# EAGLE design TSOC_GROVEY_ONE_R0_1 (EAGLE 6.6.0)
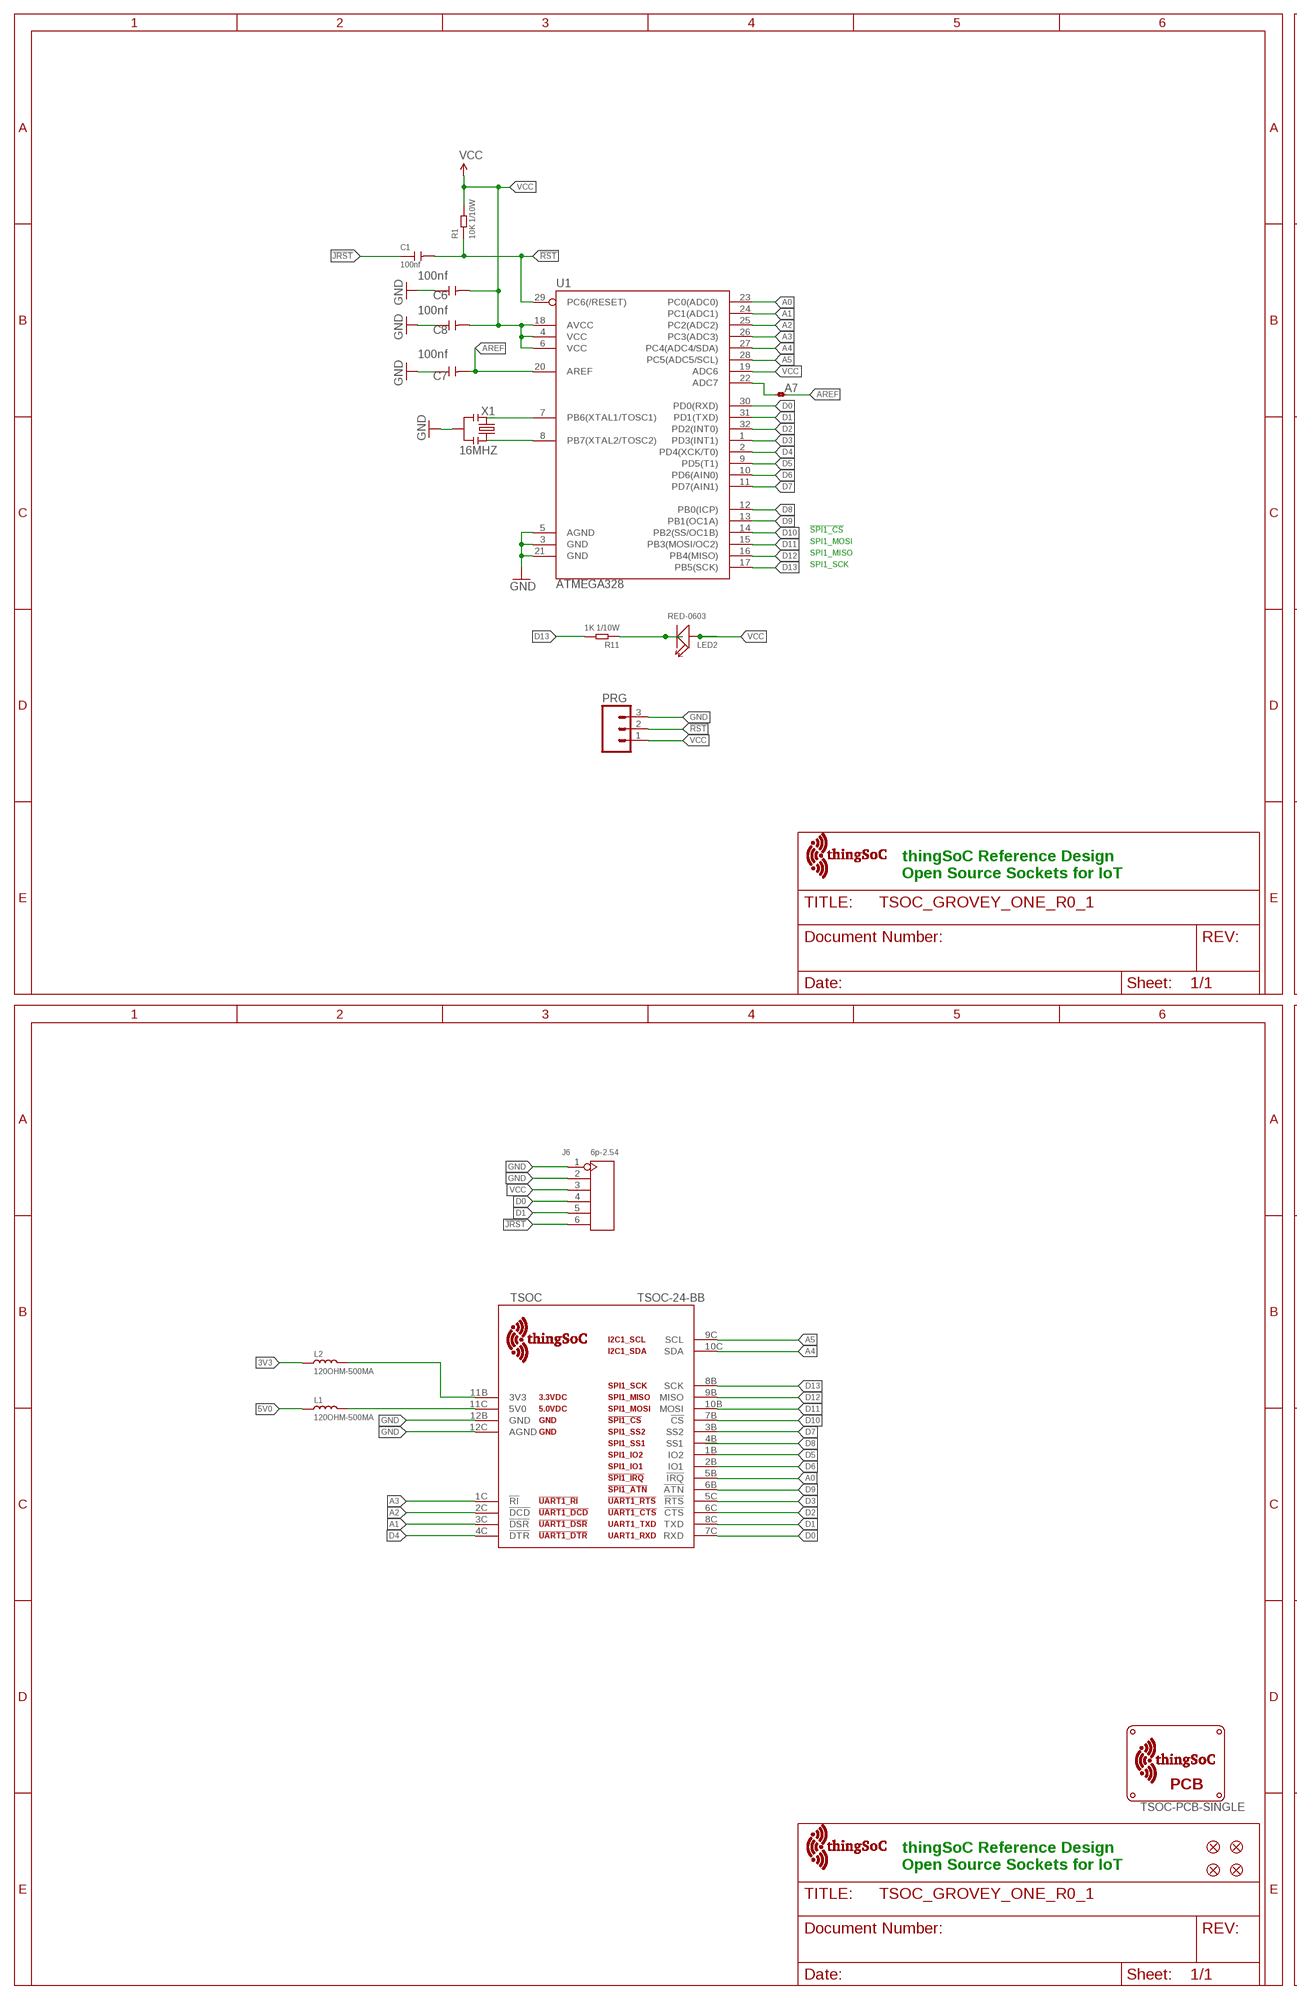
[diagram p0: schematic, sheet 1, part 1 of 2]
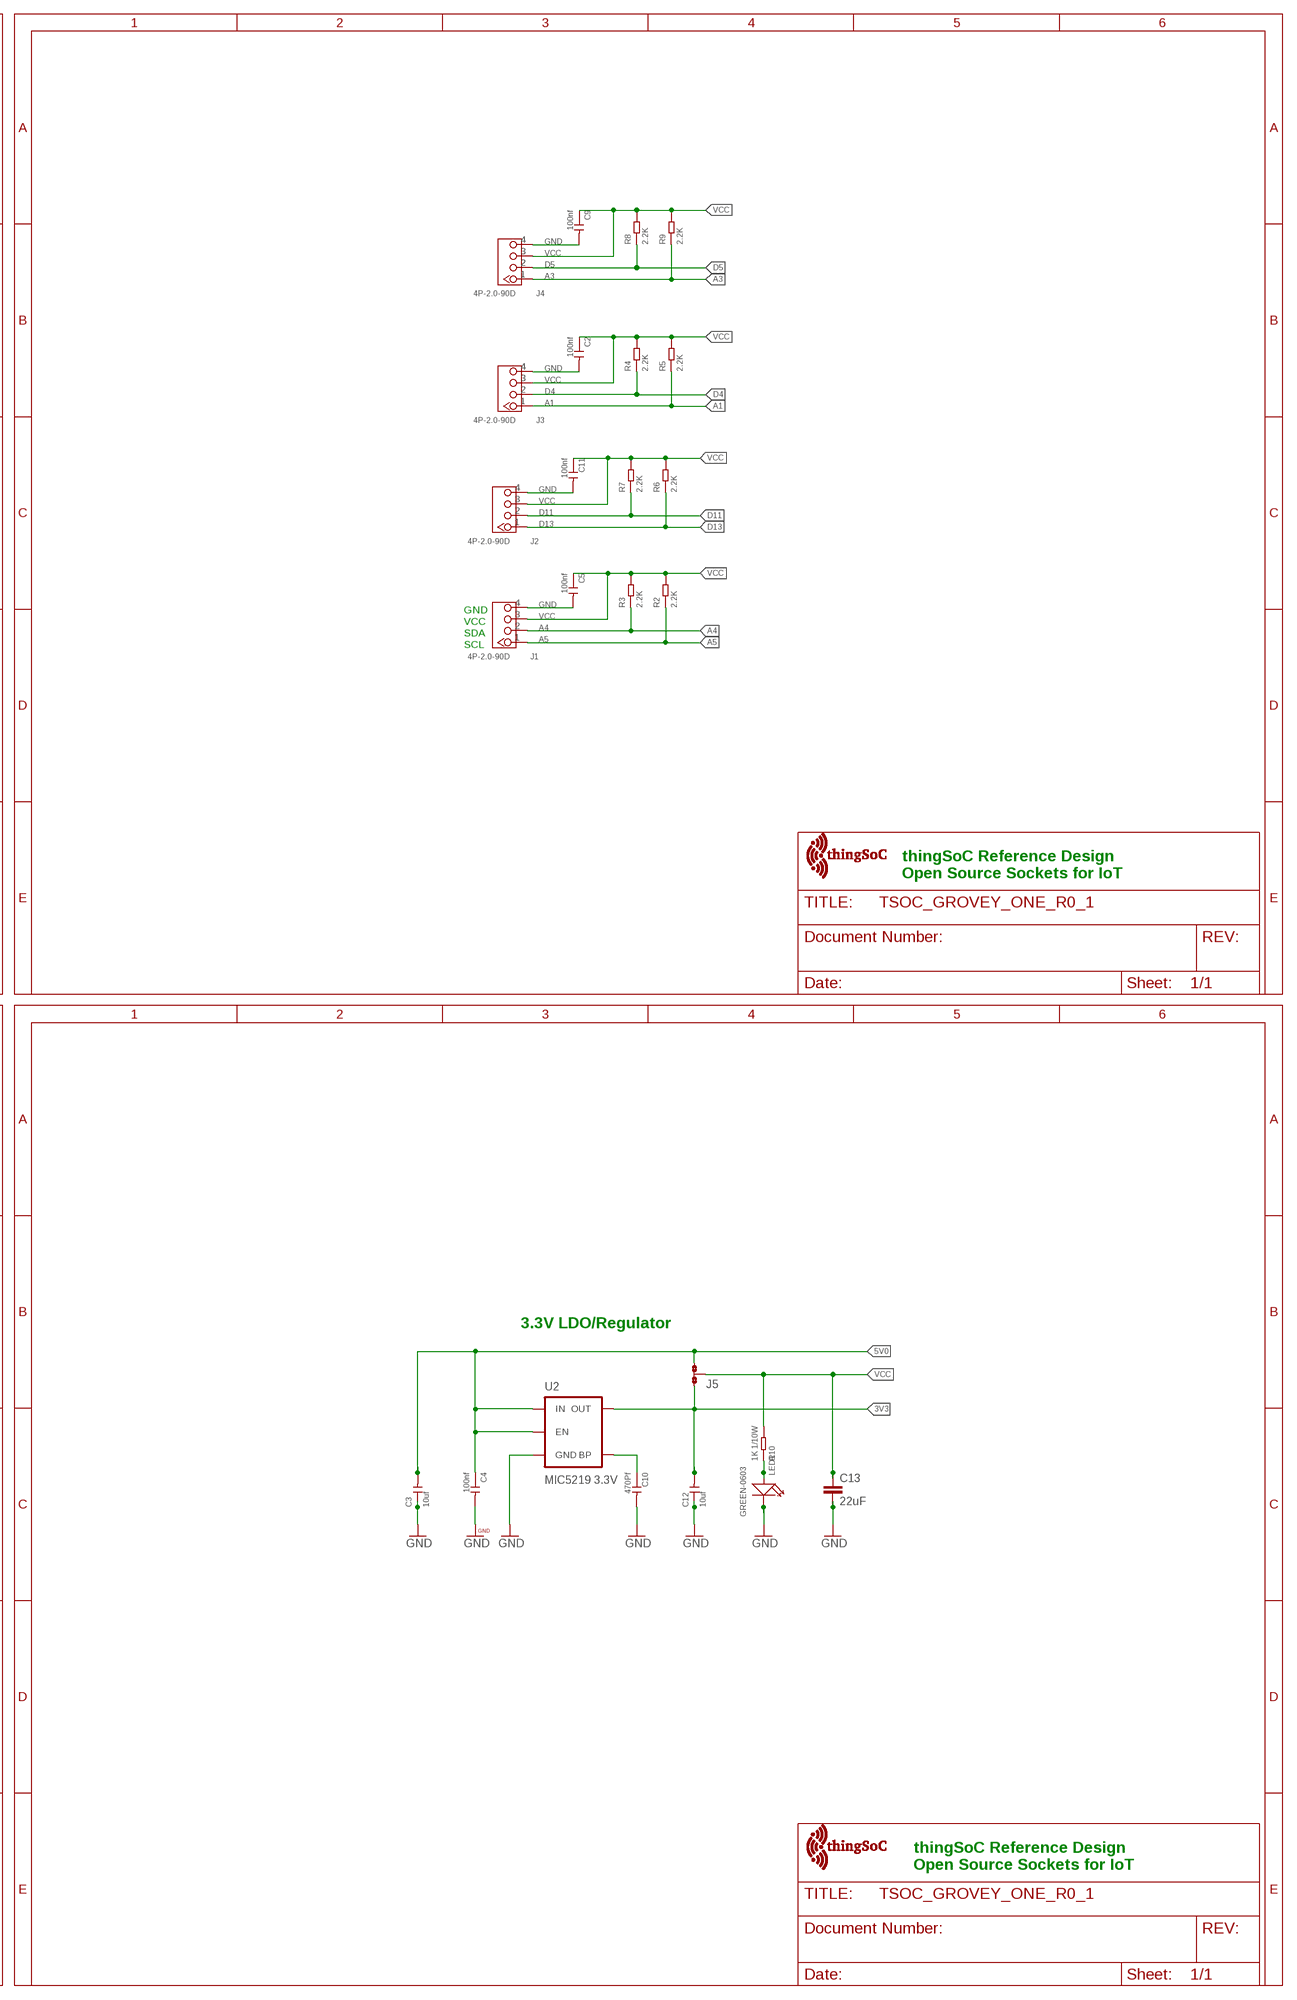
[diagram p1: schematic, sheet 1, part 2 of 2]

## Parts
$$U$2  TSOC-PCB-SINGLE  [TSOC-BB-BRD-DIM]
A7  JMP-2-NO  [JMP-2-NO]
C1  100nf  CERAMIC-100NF-50V-10%-X7R(0603)  [C0603]
C2  100nf  CERAMIC-100NF-50V-10%-X7R(0603)  [C0603]
C3  10uf  CERAMIC-10UF-10V-10%-X5R(0603)  [C0603]
C4  100nf  CERAMIC-100NF-50V-10%-X7R(0603)  [C0603]
C5  100nf  CERAMIC-100NF-50V-10%-X7R(0603)  [C0603]
C6  100nf  CERAMIC-100NF-50V-10%-X7R(0603)  [C0603]
C7  100nf  CERAMIC-100NF-50V-10%-X7R(0603)  [C0603]
C8  100nf  CERAMIC-100NF-50V-10%-X7R(0603)  [C0603]
C9  100nf  CERAMIC-100NF-50V-10%-X7R(0603)  [C0603]
C10  470Pf  CERAMIC-100NF-50V-10%-X7R(0603)  [C0603]
C11  100nf  CERAMIC-100NF-50V-10%-X7R(0603)  [C0603]
C12  10uf  CERAMIC-10UF-10V-10%-X5R(0603)  [C0603]
C13  22uF  CAP-1206  [EIA-1206]
FID1  FIDUCIALUFIDUCIAL  [MICRO-FIDUCIAL]
FID2  FIDUCIALUFIDUCIAL  [MICRO-FIDUCIAL]
FID3  FIDUCIALUFIDUCIAL  [MICRO-FIDUCIAL]
FID4  FIDUCIALUFIDUCIAL  [MICRO-FIDUCIAL]
J1  4P-2.0-90D  GROVE-CONNECTOR-DIP-90D(4P-2.0)  [HW4-2.0-90D]
J2  4P-2.0-90D  GROVE-CONNECTOR-DIP-90D(4P-2.0)  [HW4-2.0-90D]
J3  4P-2.0-90D  GROVE-CONNECTOR-DIP-90D(4P-2.0)  [HW4-2.0-90D]
J4  4P-2.0-90D  GROVE-CONNECTOR-DIP-90D(4P-2.0)  [HW4-2.0-90D]
J5  NO  JMP-3-NO-PTH  [JMP-3-NO-PTH-2.54]
J6  6p-2.54  DIP-BLACK-MALE-HEADER(6P-2.54)  [H6-2.54]
L1  120OHM-500MA  SMD-FERRITE-CHIP-120-OHM-500MA(0603)  [L0603]
L2  120OHM-500MA  SMD-FERRITE-CHIP-120-OHM-500MA(0603)  [L0603]
LED1  GREEN-0603  SMD-LED-CLEAR-GREEN(0603)  [LED-0603]
LED2  RED-0603  SMD-LED-CLEAR-GREEN(0603)  [LED-0603]
PRG  M03PTH  [1X03]
R1  10K 1/10W  SMD-RES-10K-5%-1/10W(0603)  [R0603]
R2  2.2K  SMD-RES-2.2K-5%-1/10W(0603)  [R0603]
R3  2.2K  SMD-RES-2.2K-5%-1/10W(0603)  [R0603]
R4  2.2K  SMD-RES-2.2K-5%-1/10W(0603)  [R0603]
R5  2.2K  SMD-RES-2.2K-5%-1/10W(0603)  [R0603]
R6  2.2K  SMD-RES-2.2K-5%-1/10W(0603)  [R0603]
R7  2.2K  SMD-RES-2.2K-5%-1/10W(0603)  [R0603]
R8  2.2K  SMD-RES-2.2K-5%-1/10W(0603)  [R0603]
R9  2.2K  SMD-RES-2.2K-5%-1/10W(0603)  [R0603]
R10  1K 1/10W  SMD-RES-1K-5%-1/10W(0603)  [R0603]
R11  1K 1/10W  SMD-RES-1K-5%-1/10W(0603)  [R0603]
TSOC  TSOC-24-BB  [TSOC-BB-S24]
U1  ATMEGA328  ATMEGA168  [TQFP32-08]
U2  MIC5219 3.3V  V_REG_MIC52193.3V  [SOT23-5]
U$3  TSOC-LOGO-SMALL  [TSOC-LOGO-SML]
U$100  TSOC-LOGO-SMALL  [TSOC-LOGO-SML]
U$101  TSOC-LOGO-LRG  [TSOC-LOGO-LRG]
U$103  TSOC-LOGO-SMALL  [TSOC-LOGO-SML]
X1  16MHZ  SMD-RESONATOR-16MHZ-15PF-0.5%-40R(3P-3.2X1.3MM)  [X3-SMD-3.6X1.3X0.8MM]

## Nets
3V3: C12.2 J5.1 L2.1 U2.5(OUT)
5V0: C3.2 C4.1 J5.3 L1.1 U2.1(IN) U2.3(EN)
!JRST: C1.1 J6.6
!RST: C1.2 PRG.2 R1.1 U1.29(PC6(/RESET))
A0: TSOC.5B(!IRQ) U1.23(PC0(ADC0))
A1: J3.1 R5.1 TSOC.3C(!DSR) U1.24(PC1(ADC1))
A2: TSOC.2C(!DCD) U1.25(PC2(ADC2))
A3: J4.1 R9.1 TSOC.1C(!RI) U1.26(PC3(ADC3))
A4: J1.2 R3.1 TSOC.10C(SDA) U1.27(PC4(ADC4/SDA))
A5: J1.1 R2.1 TSOC.9C(SCL) U1.28(PC5(ADC5/SCL))
A7: A7.1 U1.22(ADC7)
AREF: A7.2 C7.2 U1.20(AREF)
BYPASS1: C10.1 U2.4(BP)
D0: J6.4 TSOC.7C(RXD) U1.30(PD0(RXD))
D1: J6.5 TSOC.8C(TXD) U1.31(PD1(TXD))
D2: TSOC.6C(!CTS) U1.32(PD2(INT0))
D3: TSOC.5C(!RTS) U1.1(PD3(INT1))
D4: J3.2 R4.1 TSOC.4C(!DTR) U1.2(PD4(XCK/T0))
D5: J4.2 R8.1 TSOC.1B(IO2) U1.9(PD5(T1))
D6: TSOC.2B(IO1) U1.10(PD6(AIN0))
D7: TSOC.3B(SS2) U1.11(PD7(AIN1))
D8: TSOC.4B(SS1) U1.12(PB0(ICP))
D9: TSOC.6B(!ATN) U1.13(PB1(OC1A))
D10: TSOC.7B(!CS) U1.14(PB2(SS/OC1B))
D11: J2.2 R7.1 TSOC.10B(MOSI) U1.15(PB3(MOSI/OC2))
D12: TSOC.9B(MISO) U1.16(PB4(MISO))
D13: J2.1 R6.1 R11.2 TSOC.8B(SCK) U1.17(PB5(SCK))
GND: C2.2 C3.1 C4.2 C5.2 C6.1 C7.1 C8.1 C9.2 C10.2 C11.2 C12.1 C13.2 J1.4 J2.4 J3.4 J4.4 J6.1 J6.2 LED1.- PRG.3 TSOC.12B(GND) TSOC.12C(AGND) U1.3(GND) U1.5(AGND) U1.21(GND) U2.2(GND) X1.2
LEDR: LED2.- R11.1
N$17: LED1.+ R10.1
TSOC_3V3: L2.2 TSOC.11B(3V3)
TSOC_5V0: L1.2 TSOC.11C(5V0)
VCC: C2.1 C5.1 C6.2 C8.2 C9.1 C11.1 C13.1 J1.3 J2.3 J3.3 J4.3 J5.2 J6.3 LED2.+ PRG.1 R1.2 R2.2 R3.2 R4.2 R5.2 R6.2 R7.2 R8.2 R9.2 R10.2 U1.4(VCC) U1.6(VCC) U1.18(AVCC) U1.19(ADC6)
XIN: U1.7(PB6(XTAL1/TOSC1)) X1.3
XOUT: U1.8(PB7(XTAL2/TOSC2)) X1.1

## Notes on the sheet
- !SPI1_CS
- SPI1_MOSI
- SPI1_MISO
- SPI1_SCK
- GND
- VCC
- SDA
- SCL
- thingSoC Reference Design
  Open Source Sockets for IoT
- thingSoC Reference Design
  Open Source Sockets for IoT
- 3.3V LDO/Regulator
- thingSoC Reference Design
  Open Source Sockets for IoT
- thingSoC Reference Design
  Open Source Sockets for IoT

## Library data of the parts
$$U$2 = thingSoC:TSOC-PCB: thingSoC PCB Outlines Boards Outlines for Standard Sizes (in the DImension Layer) (Registration marks in the tDocu layer - make sure to turn on tDocu/bDocu) Source LBR : http://www.thingsoc.com Github : https://github.com/thingsoc License : http://creativecommons.org/licenses/by-sa/4.0/ (Creative Commons 4.0) THIS SOFTWARE IS PROVIDED BY THE CONTRIBUTORS "AS IS" AND WITHOUT ANY EXPRESS OR IMPLIED WARRANTIES, INCLUDING, BUT NOT LIMITED TO, THE IMPLIED WARRANTIES OF MERCHANTABILITY AND FITNESS FOR A PARTICULAR PURPOSE ARE DISCLAIMED. IN NO EVENT SHALL THE COPYRIGHT OWNER OR CONTRIBUTORS BE LIABLE FOR ANY DIRECT, INDIRECT, INCIDENTAL, SPECIAL, EXEMPLARY, OR CONSEQUENTIAL DAMAGES (INCLUDING, BUT NOT LIMITED TO, PROCUREMENT OF SUBSTITUTE GOODS OR SERVICES; LOSS OF USE, DATA, OR PROFITS; OR BUSINESS INTERRUPTION) HOWEVER CAUSED AND ON ANY THEORY OF LIABILITY, WHETHER IN CONTRACT, STRICT LIABILITY, OR TORT (INCLUDING NEGLIGENCE OR OTHERWISE) ARISING IN ANY WAY OUT OF THE USE OF THIS SOFTWARE, EVEN IF ADVISED OF THE POSSIBILITY OF SUCH DAMAGE.
A7 = PatternAgents-ProtoPads:JMP-2-NO: Two Terminal Jumper - Normally Open Positions 1 and 2 are normally NOT connected. PatternAgents ProtoPads Library Schematic and PCB layout libraries for design patterns by PatternAgents. For the CADSoft Eagle CAD program : http://www.cadsoftusa.com/download-eagle/ Source LBR : http://www.patternagents.com Github : https://github.com/PatternAgents License : http://creativecommons.org/licenses/by-sa/4.0/ (Creative Commons 4.0) THIS SOFTWARE IS PROVIDED BY THE CONTRIBUTORS "AS IS" AND WITHOUT ANY EXPRESS OR IMPLIED WARRANTIES, INCLUDING, BUT NOT LIMITED TO, THE IMPLIED WARRANTIES OF MERCHANTABILITY AND FITNESS FOR A PARTICULAR PURPOSE ARE DISCLAIMED. IN NO EVENT SHALL THE COPYRIGHT OWNER OR CONTRIBUTORS BE LIABLE FOR ANY DIRECT, INDIRECT, INCIDENTAL, SPECIAL, EXEMPLARY, OR CONSEQUENTIAL DAMAGES (INCLUDING, BUT NOT LIMITED TO, PROCUREMENT OF SUBSTITUTE GOODS OR SERVICES; LOSS OF USE, DATA, OR PROFITS; OR BUSINESS INTERRUPTION) HOWEVER CAUSED AND ON ANY THEORY OF LIABILITY, WHETHER IN CONTRACT, STRICT LIABILITY, OR TORT (INCLUDING NEGLIGENCE OR OTHERWISE) ARISING IN ANY WAY OUT OF THE USE OF THIS SOFTWARE, EVEN IF ADVISED OF THE POSSIBILITY OF SUCH DAMAGE.; BOM: EXCLUDE
C1 C2 C4-C9 C11 = Seeed-Capacitor-2016:CERAMIC-100NF-50V-10%-X7R(0603): 302010138; MPN: CC0603KRX7R9BB104
C3 C12 = Seeed-Capacitor-2016:CERAMIC-10UF-10V-10%-X5R(0603): 302010103; MPN: CC0603KRX5R6BB106
C10 = Seeed-Capacitor-2016:CERAMIC-100NF-50V-10%-X7R(0603): 302010138; MPN: CC0603KRX7R9BB104; VALUE: 100nf
C13 = TSOC_USBUART2:CAP: Ceramic Capacitor SMD
FID1-FID4 = TSOC-ESP8266-BASE:FIDUCIAL: Fiducial Alignment Points Various fiducial points for machine vision alignment.
J1-J4 = Seeed-Connector -2016:GROVE-CONNECTOR-DIP-90D(4P-2.0): 320110034
J5 = PatternAgents-ProtoPads:JMP-3-NO: Three Terminal Jumper - Normally Open All Pads Open (unconnected) PatternAgents ProtoPads Library Schematic and PCB layout libraries for design patterns by PatternAgents. For the CADSoft Eagle CAD program : http://www.cadsoftusa.com/download-eagle/ Source LBR : http://www.patternagents.com Github : https://github.com/PatternAgents License : http://creativecommons.org/licenses/by-sa/4.0/ (Creative Commons 4.0) THIS SOFTWARE IS PROVIDED BY THE CONTRIBUTORS "AS IS" AND WITHOUT ANY EXPRESS OR IMPLIED WARRANTIES, INCLUDING, BUT NOT LIMITED TO, THE IMPLIED WARRANTIES OF MERCHANTABILITY AND FITNESS FOR A PARTICULAR PURPOSE ARE DISCLAIMED. IN NO EVENT SHALL THE COPYRIGHT OWNER OR CONTRIBUTORS BE LIABLE FOR ANY DIRECT, INDIRECT, INCIDENTAL, SPECIAL, EXEMPLARY, OR CONSEQUENTIAL DAMAGES (INCLUDING, BUT NOT LIMITED TO, PROCUREMENT OF SUBSTITUTE GOODS OR SERVICES; LOSS OF USE, DATA, OR PROFITS; OR BUSINESS INTERRUPTION) HOWEVER CAUSED AND ON ANY THEORY OF LIABILITY, WHETHER IN CONTRACT, STRICT LIABILITY, OR TORT (INCLUDING NEGLIGENCE OR OTHERWISE) ARISING IN ANY WAY OUT OF THE USE OF THIS SOFTWARE, EVEN IF ADVISED OF THE POSSIBILITY OF SUCH DAMAGE.
J6 = Seeed-Connector -2016:DIP-BLACK-MALE-HEADER(6P-2.54): 320020078; MPN: P125-1106A1BS116A1
L1 L2 = Seeed-Inductor-2016:SMD-FERRITE-CHIP-120-OHM-500MA(0603): 303030001; MPN: BLM18AG121SN1D
LED1 = Seeed-LED-2016:SMD-LED-CLEAR-GREEN(0603): 304090043; MPN: 19-217-G7C-AN1P2-3T
LED2 = Seeed-LED-2016:SMD-LED-CLEAR-GREEN(0603): 304090043; MPN: 19-217-G7C-AN1P2-3T; VALUE: GREEN-0603
PRG = PatternAgents-ProtoPads:M03: Header 3 Standard 3-pin 0.1" header. Use with straight break away headers (SKU : PRT-00116), right angle break away headers (PRT-00553), swiss pins (PRT-00743), machine pins (PRT-00117), and female headers (PRT-00115). Molex polarized connector foot print use with SKU : PRT-08232 with associated crimp pins and housings.
R1 = Seeed-Resistor-2016:SMD-RES-10K-5%-1/10W(0603): 301010293; MPN: RC0603JR-0710KL
R2-R9 = Seeed-Resistor-2016:SMD-RES-2.2K-5%-1/10W(0603): 301010124; MPN: RC0603JR-072K2L
R10 R11 = Seeed-Resistor-2016:SMD-RES-1K-5%-1/10W(0603): 301010291; MPN: RC0603JR-071KL
TSOC = thingSoC:TSOC-24: thingSoC Twenty-Four(24) Pin Socket Source LBR : http://www.thingsoc.com Github : https://github.com/thingsoc License : http://creativecommons.org/licenses/by-sa/4.0/ (Creative Commons 4.0) THIS SOFTWARE IS PROVIDED BY THE CONTRIBUTORS "AS IS" AND WITHOUT ANY EXPRESS OR IMPLIED WARRANTIES, INCLUDING, BUT NOT LIMITED TO, THE IMPLIED WARRANTIES OF MERCHANTABILITY AND FITNESS FOR A PARTICULAR PURPOSE ARE DISCLAIMED. IN NO EVENT SHALL THE COPYRIGHT OWNER OR CONTRIBUTORS BE LIABLE FOR ANY DIRECT, INDIRECT, INCIDENTAL, SPECIAL, EXEMPLARY, OR CONSEQUENTIAL DAMAGES (INCLUDING, BUT NOT LIMITED TO, PROCUREMENT OF SUBSTITUTE GOODS OR SERVICES; LOSS OF USE, DATA, OR PROFITS; OR BUSINESS INTERRUPTION) HOWEVER CAUSED AND ON ANY THEORY OF LIABILITY, WHETHER IN CONTRACT, STRICT LIABILITY, OR TORT (INCLUDING NEGLIGENCE OR OTHERWISE) ARISING IN ANY WAY OUT OF THE USE OF THIS SOFTWARE, EVEN IF ADVISED OF THE POSSIBILITY OF SUCH DAMAGE.
U1 = SparkFun:ATMEGA168
U2 = TSOC-ESP8266-BASE:V_REG_MIC5219: V_REG MIC5219 Standard 3.3V and 5V 500mA LDO voltage regulator in SOT-23 layout. Micrel part MIC5219. BP (by-pass) pin is used to lower output noise with 470pF cap, may be left open.; PROD_ID: VREG-09872
U$3 U$100 U$101 U$103 = thingSoC:TSOC-LOGO: thingSoC Logo Source LBR : http://www.thingsoc.com Github : https://github.com/thingsoc License : http://creativecommons.org/licenses/by-sa/4.0/ (Creative Commons 4.0) THIS SOFTWARE IS PROVIDED BY THE CONTRIBUTORS "AS IS" AND WITHOUT ANY EXPRESS OR IMPLIED WARRANTIES, INCLUDING, BUT NOT LIMITED TO, THE IMPLIED WARRANTIES OF MERCHANTABILITY AND FITNESS FOR A PARTICULAR PURPOSE ARE DISCLAIMED. IN NO EVENT SHALL THE COPYRIGHT OWNER OR CONTRIBUTORS BE LIABLE FOR ANY DIRECT, INDIRECT, INCIDENTAL, SPECIAL, EXEMPLARY, OR CONSEQUENTIAL DAMAGES (INCLUDING, BUT NOT LIMITED TO, PROCUREMENT OF SUBSTITUTE GOODS OR SERVICES; LOSS OF USE, DATA, OR PROFITS; OR BUSINESS INTERRUPTION) HOWEVER CAUSED AND ON ANY THEORY OF LIABILITY, WHETHER IN CONTRACT, STRICT LIABILITY, OR TORT (INCLUDING NEGLIGENCE OR OTHERWISE) ARISING IN ANY WAY OUT OF THE USE OF THIS SOFTWARE, EVEN IF ADVISED OF THE POSSIBILITY OF SUCH DAMAGE.
X1 = Seeed-Crystal Oscillator-2016:SMD-RESONATOR-16MHZ-15PF-0.5%-40R(3P-3.2X1.3MM): 306030002; MPN: CSTCE16M0V53-R0

## Board
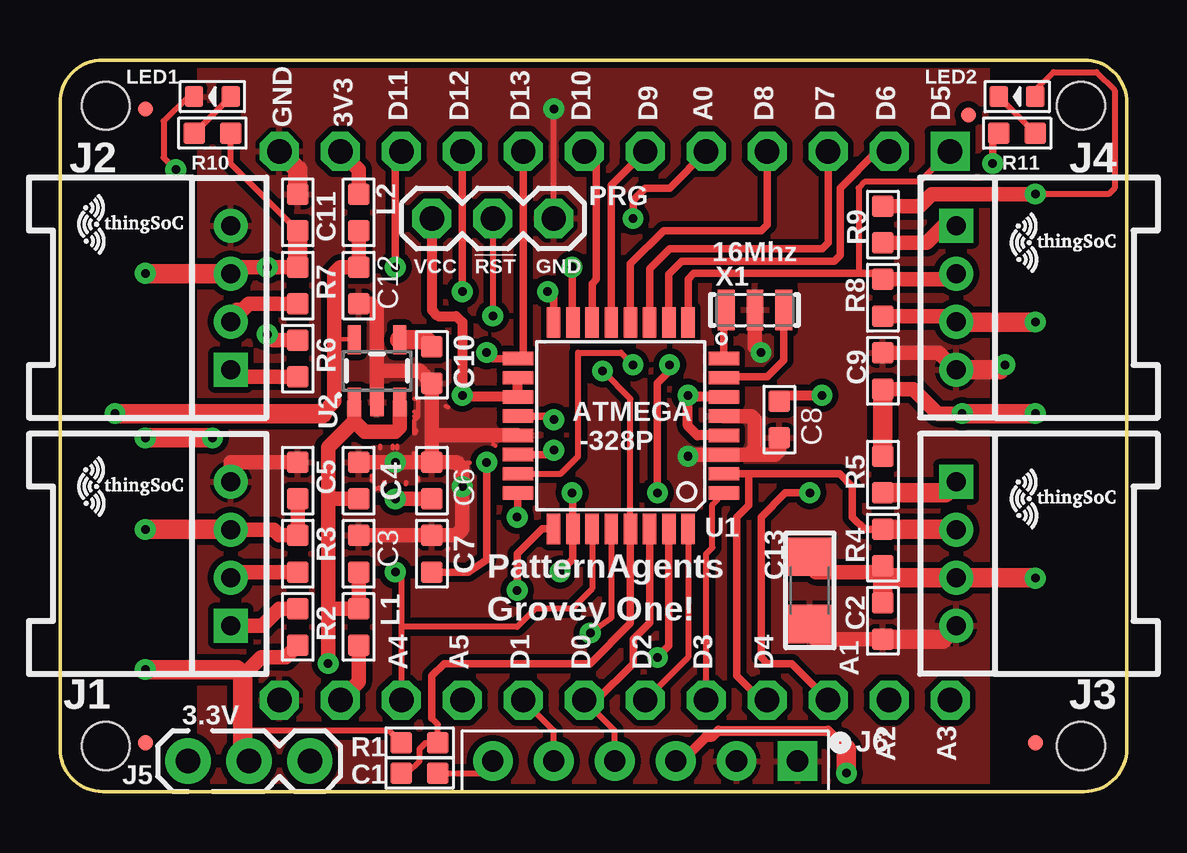
[diagram p2: board, top side]
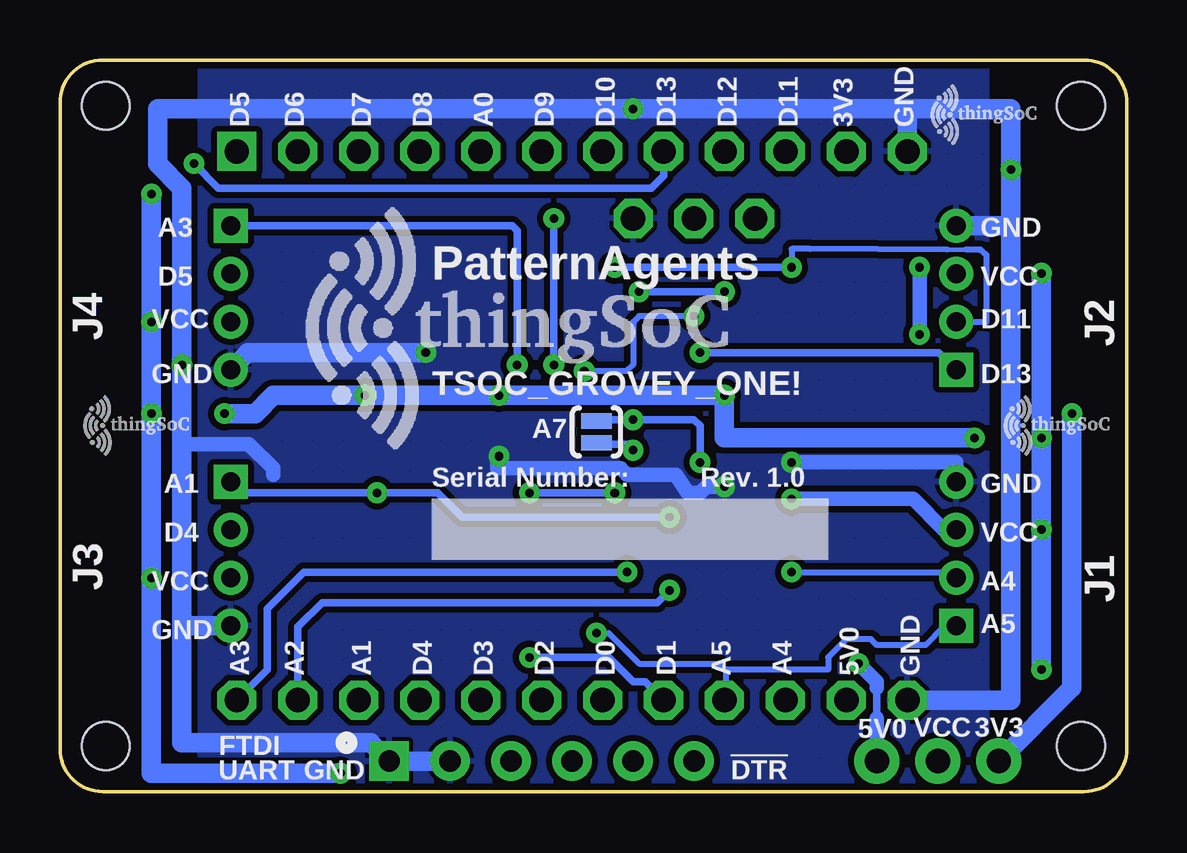
[diagram p3: board, bottom side, seen from below]

Size 44.45 x 30.48 mm. Coordinates in mm from the lower left corner, seen from the top.
Copper layers (1*16): Top 0.035mm / dielectric 1.5mm / Bottom 0.035mm
Design rules "PatternAgents_7mil": minimum track width 7mil, minimum drill 14mil, track to track 7mil, track to pad 7mil, pad to pad 7mil, via to via 7mil, smd to smd 7mil, copper to edge 7mil, drill to drill 7mil, minimum pad ring 12mil, minimum via ring 10mil, stop-mask expansion 4mil, vias tented up to drill 25mil, thermal gap 7mil

### Footprints (pad centres in the part's own frame; a part is rotated, then mirrored left to right if it is on the bottom)
TSOC-BB-BRD-DIM = hole 2: 13.335,16.891; -13.335,16.891; 13.335,-23.749; -13.335,-23.749
JMP-2-NO = smd 0.635 x 1.27: 1 -0.45,0; 2 0.45,0
C0603 = smd 0.889 x 0.889: 1 0,0.762; 2 0,-0.762
EIA-1206 = smd 1.6 x 1.8: 1 -1.4,0; 2 1.4,0
MICRO-FIDUCIAL = smd 0.635 x 0.635: 1 0,0
HW4-2.0-90D = drill 0.8 pad 1.27 square: 1 -3,0 | drill 0.8 pad 1.27: 2 -1,0; 3 1,0; 4 3,0
JMP-3-NO-PTH-2.54 = drill 1.016 pad 1.88: 1 0,0; 2 2.54,0; 3 5.08,0
H6-2.54 = drill 0.889 pad 1.651 square: 1 0,6.35 | drill 0.889 pad 1.651: 2 0,3.81; 3 0,1.27; 4 0,-1.27; 5 0,-3.81; 6 0,-6.35
L0603 = smd 0.889 x 0.889: 1 -0.762,0; 2 0.762,0
LED-0603 = smd 0.762 x 0.889: + -0.762,0; - 0.762,0
1X03 = drill 1.016 octagon: 1 0,0; 2 2.54,0; 3 5.08,0
R0603 = smd 0.889 x 0.889: 1 0,0.762; 2 0,-0.762
TSOC-BB-S24 = drill 1.016 square: 1B -11.43,11.43 | drill 1.016 octagon: 1C 11.43,11.43; 2B -11.43,8.89; 2C 11.43,8.89; 3B -11.43,6.35; 3C 11.43,6.35; 4B -11.43,3.81; 4C 11.43,3.81; 5B -11.43,1.27; 5C 11.43,1.27; 6B -11.43,-1.27; 6C 11.43,-1.27; 7B -11.43,-3.81; 7C 11.43,-3.81; 8B -11.43,-6.35; 8C 11.43,-6.35; 9B -11.43,-8.89; 9C 11.43,-8.89; 10B -11.43,-11.43; 10C 11.43,-11.43; 11B -11.43,-13.97; 11C 11.43,-13.97; 12B -11.43,-16.51; 12C 11.43,-16.51
TQFP32-08 = smd 1.27 x 0.559: 1 -4.293,2.8; 2 -4.293,2; 3 -4.293,1.2; 4 -4.293,0.4; 5 -4.293,-0.4; 6 -4.293,-1.2; 7 -4.293,-2; 8 -4.293,-2.8; 17 4.293,-2.8; 18 4.293,-2; 19 4.293,-1.2; 20 4.293,-0.4; 21 4.293,0.4; 22 4.293,1.2; 23 4.293,2; 24 4.293,2.8 | smd 0.559 x 1.27: 9 -2.8,-4.293; 10 -2,-4.293; 11 -1.2,-4.293; 12 -0.4,-4.293; 13 0.4,-4.293; 14 1.2,-4.293; 15 2,-4.293; 16 2.8,-4.293; 25 2.8,4.293; 26 2,4.293; 27 1.2,4.293; 28 0.4,4.293; 29 -0.4,4.293; 30 -1.2,4.293; 31 -2,4.293; 32 -2.8,4.293
SOT23-5 = smd 0.55 x 1.2: 1 -0.95,-1.3; 2 0,-1.3; 3 0.95,-1.3; 4 0.95,1.3; 5 -0.95,1.3
X3-SMD-3.6X1.3X0.8MM = smd 0.7 x 1.7: 1 -1.2,0; 2 0,0; 3 1.2,0

### Placement (x,y rotation side)
$$U$2  25.65,15.24 270 top
A7  22.1,14.99 90 bottom
C1  14.99,0.76 270 top
C2  34.29,7.11 0 top
C3  12.45,9.91 0 top
C4  12.45,12.95 180 top
C5  9.91,12.95 180 top
C6  15.49,12.95 0 top
C7  15.49,9.91 0 top
C8  29.97,15.49 180 top
C9  34.29,17.53 180 top
C10  15.49,17.78 0 top
C11  9.91,24.13 180 top
C12  12.45,21.08 180 top
C13  31.24,8.38 270 top
FID1  3.56,2.03 0 top
FID2  40.64,2.03 0 top
FID3  37.85,28.19 0 top
FID4  3.56,28.45 0 top
J1  7.11,9.91 90 top
J2  7.11,20.57 90 top
J3  37.34,9.91 270 top
J4  37.34,20.57 270 top
J5  5.33,1.27 0 top
J6  24.38,1.27 270 top
L1  12.45,6.86 270 top
L2  12.45,24.13 90 top
LED1  6.35,28.96 180 top
LED2  39.88,28.96 180 top
PRG  15.49,23.88 0 top
R1  14.99,2.03 270 top
R2  9.91,6.86 0 top
R3  9.91,9.91 180 top
R4  34.29,10.16 0 top
R5  34.29,13.21 180 top
R6  9.91,18.03 180 top
R7  9.91,21.08 180 top
R8  34.29,20.57 0 top
R9  34.29,23.62 180 top
R10  6.35,27.43 90 top
R11  39.88,27.43 270 top
TSOC  25.65,15.24 270 top
U1  23.37,15.24 180 top
U2  13.21,17.53 0 top
U$1  TSOC-LOGO-SMALL  [TSOC-LOGO-SML]  1.52,23.62 0 top
U$3  1.52,12.7 0 top
U$4  TSOC-LOGO-SMALL  [TSOC-LOGO-SML]  40.39,22.86 0 top
U$5  TSOC-LOGO-SMALL  [TSOC-LOGO-SML]  40.39,12.19 0 top
U$100  7.37,28.19 0 bottom
U$101  30.99,19.3 0 bottom
U$102  TSOC-LOGO-SMALL  [TSOC-LOGO-SML]  4.32,15.24 0 bottom
U$103  42.67,15.24 0 bottom
X1  28.96,20.07 0 top

### Tracks (layer width: path | path; a pad name or v marks a point on that pad's centre or on a via)
3V3  (via drill 0.36)
  Top 0.178: 11.43,18.85 12.09,18.85 U2.5
  Top 0.61: L2.1 C12.2 11.68,21.84 11.43,21.59 11.43,18.85 11.43,16.26 10.92,15.75
  Top 0.813: 10.92,15.75 v2.29,15.75
  Bottom 0.813: v2.29,15.75 2.29,4.32 J5.1
5V0  (via drill 0.36)
  Top 0.61: C3.2 L1.1 11.18,7.62 | U2.3 14.16,15.17 13.97,14.99 12.7,14.99 12.26,15.43 | U2.1 12.26,15.43 | 11.18,12.19 11.18,14.35 12.26,15.43 | 11.18,12.19 11.18,7.62 | 11.18,7.62 v11.18,5.33 | C4.1 11.18,12.19
  Bottom 0.305: 10.41,3.05 10.41,4.32
  Bottom 0.61: J5.3 10.41,3.05 | 10.41,4.32 10.41,4.57 v11.18,5.33
!JRST
  Top 0.254: C1.1 17.53,0.76 J6.6
!RST  (via drill 0.36)
  Top 0.254: C1.2 14.48,0.76 14.99,1.27 14.99,1.78 15.24,2.03 R1.1 15.75,2.79 15.49,3.05 | PRG.2 v18.03,19.81 | U1.29 23.77,16.36 v22.61,17.53
  Top 0.305: U1.29 23.77,7 22.1,5.33 16,5.33 15.49,4.83 15.49,3.05
  Bottom 0.254: v18.03,19.81 20.32,19.81 20.57,19.56 20.57,17.78 20.83,17.53 v22.61,17.53
A0  (via drill 0.36)
  Top 0.254: U1.23 20.86,13.24 21.59,13.97 21.59,18.29 23.37,18.29 v23.88,17.78
  Top 0.305: TSOC.5B 25.4,25.15 24.38,25.15 23.88,24.64 v23.88,23.88
  Bottom 0.305: v23.88,23.88 v23.88,17.78
A1  (via drill 0.36)
  Top 0.305: U1.24 19.07,11.71 v19.05,11.43 | v31.24,12.45 30.23,12.45 29.21,11.43 29.21,5.59 29.46,5.33 30.48,5.33 TSOC.3C
  Top 0.813: R5.1 36.88,12.45 J3.1
  Bottom 0.305: J3.1 37.34,12.45 v31.24,12.45 28.7,12.45 27.69,11.43 v19.05,11.43
A2  (via drill 0.36)
  Top 0.305: U1.25 20.09,10.95 19.05,9.91 v19.05,8.38
  Bottom 0.305: TSOC.2C 34.54,6.86 33.53,7.87 19.56,7.87 v19.05,8.38
A3  (via drill 0.36)
  Top 0.305: v20.83,9.14 21.37,9.68 U1.26 21.37,12.16 v21.34,12.45 | v25.4,17.78 25.4,17.53 24.89,17.02 v24.89,12.45
  Top 0.61: R9.1 36.12,22.86 36.83,23.57 J4.1
  Bottom 0.305: J4.1 25.61,23.57 25.4,23.37 v25.4,17.78 | v20.83,9.14 34.29,9.14 35.81,7.62 35.81,5.08 TSOC.1C | v21.34,12.45 v24.89,12.45
A4  (via drill 0.36)
  Top 0.254: U1.27 22.17,8.45 21.34,7.62 19.81,7.62 19.05,6.86 14.22,6.86 | 14.22,6.86 14.22,8.89 v13.97,9.14 | 14.22,6.86 TSOC.10C
  Top 0.61: R3.1 7.35,9.14 J1.2
  Bottom 0.254: v13.97,9.14 7.35,9.14 J1.2
A5  (via drill 0.36)
  Top 0.254: U1.28 22.97,7.22 v22.1,6.6
  Top 0.61: J1.1 8.43,6.91 9.14,7.62 R2.1
  Bottom 0.178: 7.11,6.93 J1.1 7.11,6.86
  Bottom 0.254: 7.11,6.86 7.62,6.86 8.38,6.1 10.41,6.1 10.67,6.35 11.68,6.35 12.45,5.59 12.45,5.08 16.72,5.08 | 16.72,5.08 16.72,3.86 TSOC.9C | v22.1,6.6 21.59,6.6 20.32,5.33 16.97,5.33 16.72,5.08
A7  (via drill 0.36)
  Top 0.305: U1.22 20.39,14.04 v20.57,14.22
  Bottom 0.305: v20.57,14.22 20.83,14.48 22.04,14.48 A7.1
AREF  (via drill 0.36)
  Top 0.305: U1.20 20.43,15.64 v20.57,15.49 | C7.2 17.02,9.14 17.78,9.65 v17.78,13.72
  Bottom 0.305: A7.2 22.04,15.49 v20.57,15.49 18.03,15.49 17.78,15.24 v17.78,13.72
BYPASS1
  Top 0.813: U2.4 15.21,18.83 C10.1
D0
  Top 0.254: J6.4 23.11,2.54 TSOC.7C
  Top 0.305: U1.30 24.57,7.04 23.88,6.35 23.88,5.33 22.35,3.81 TSOC.7C
D1  (via drill 0.36)
  Top 0.254: J6.5 20.57,2.54 TSOC.8C
  Top 0.305: U1.31 25.37,6.06 v24.89,5.59
  Bottom 0.305: v24.89,5.59 21.59,5.59 20.57,4.57 20.07,4.57 TSOC.8C
D2
  Top 0.254: U1.32 26.17,5.59 TSOC.6C
D3
  Top 0.254: TSOC.5C 26.92,9.91 27.18,10.16 27.18,11.96 U1.1
D4
  Top 0.305: U1.2 28.7,13.24 | 28.7,13.24 32.48,13.24 33.02,12.7 33.02,11.43 33.53,10.92 R4.1 | TSOC.4C 29.21,3.81 28.19,4.83 28.19,11.43 28.7,11.94 28.7,13.24
  Top 0.813: R4.1 37.32,10.92 J3.2
D5
  Top 0.254: TSOC.1B 35.81,25.4 33.53,25.4 33.27,25.15 33.27,21.59
  Top 0.305: U1.9 26.17,21.34 26.42,21.59 33.27,21.59 34.04,21.59 R8.1
  Top 0.61: R8.1 37.1,21.34 J4.2
D6
  Top 0.305: U1.10 25.37,21.56 25.91,22.1 32.26,22.1 32.51,22.35 32.51,25.15 34.04,26.67 TSOC.2B
D7
  Top 0.305: U1.11 24.57,21.77 25.4,22.61 31.75,22.61 32,22.86 TSOC.3B
D8
  Top 0.305: U1.12 23.77,21.99 25.15,23.37 29.21,23.37 29.46,23.62 TSOC.4B
D9
  Top 0.305: U1.13 22.97,25.25 TSOC.6B
D10
  Top 0.305: U1.14 22.17,21.15 22.35,21.34 22.35,26.16 TSOC.7B
D11  (via drill 0.36)
  Top 0.305: v21.34,21.84 21.34,19.57 U1.15 | v13.97,21.84 13.97,26.42 TSOC.10B
  Top 0.61: J2.2 7.11,19.81 7.37,20.07 7.62,20.07 7.87,20.32 R7.1
  Bottom 0.178: 6.71,22.58 7.49,22.58
  Bottom 0.254: J2.2 5.86,19.57 5.84,19.56 5.84,22.35 6.1,22.58 6.71,22.58 | v13.97,21.84 13.97,22.61 13.21,22.61 7.49,22.58
  Bottom 0.305: v13.97,21.84 v21.34,21.84
D12  (via drill 0.36)
  Top 0.305: U1.16 20.57,20.58 v20.32,20.83 | v16.76,20.83 TSOC.9B
  Bottom 0.305: v20.32,20.83 v16.76,20.83
D13  (via drill 0.36)
  Top 0.305: TSOC.8B 19.3,18.27 U1.17 18.03,18.04 v17.78,18.29 | v38.86,26.16 38.86,27.18 R11.2
  Top 0.61: R6.1 7.41,17.27 J2.1
  Bottom 0.305: v17.78,18.29 7.83,18.29 J2.1 | TSOC.8B 19.3,25.65 19.81,25.15 37.85,25.15 v38.86,26.16
GND  (via drill 0.36)
  Top 0.178: 16.18,16 16.07,16.05 | 15.29,16.36 15.29,16.27 | 15.4,16.89 15.29,16.89 C10.2 15.47,16.89 | 14.76,15.82 14.84,15.82 | 14.76,15.65 14.84,15.65 | 13.87,14.4 13.87,14.3 | 14.05,14.4 14.05,14.3 | 13.34,14.4 13.34,14.3 | 16.54,12.62 v16.76,12.7 | C4.2 12.45,13.87 12.54,13.81 | 12.8,13.69 C4.2 | 13.16,13.51 13.2,13.62 | 13.34,12.62 13.29,12.66 | 13.16,12.62 13.28,12.65 | 14.4,12.8 14.43,12.88 | C6.1 15.47,13.51 15.4,13.62 | 14.76,13.51 14.76,13.62 | C6.1 15.29,13.87 15.4,13.81 | 15.47,13.87 C6.1 | 12.62,13.69 C4.2 | 16.71,13.87 16.51,13.72 | C4.2 12.8,13.87 12.8,13.81 | C4.2 12.45,13.69 12.54,13.62 | 12.98,12.98 13,13 | 12.98,13.16 13.04,13.05 | 13.51,12.8 13.51,12.88 | 14.94,12.98 14.9,13.05 | C6.1 15.47,13.69 15.59,13.69 | 14.76,13.87 14.74,13.87 | 15.29,14.4 15.4,14.4 | 14.76,14.05 14.74,14.1 | 15.82,13.69 C6.1 | 14.79,14.92 14.76,14.94 14.76,15.11 | 15.65,10.85 15.59,10.76 | 17.07,13.69 16.97,13.69 | 16.18,10.13 16.16,10.08 | 18.14,14.4 18.06,14.48 | 19.02,14.94 19.02,14.85 | 14.76,15.11 14.84,15.04 | 16.54,14.76 16.54,14.84 | 14.76,16.36 14.94,16.36 14.94,15.65 14.76,15.47 14.76,15.11
  Top 0.254: LED1.- 5.33,28.96 4.32,27.94 4.32,26.42 v4.83,25.91 | PRG.3 v20.57,28.45
  Top 0.61: 13.21,17.53 13.21,20.07 12.95,20.32 C12.1 | 13.21,17.53 U2.2 | C5.2 7.11,13.72 J1.4 | 13.21,17.53 14.99,17.53 C10.2 15.49,14.99 | 15.49,14.99 C6.1 | U1.21 16.54,14.84 15.64,14.84 15.49,14.99 | C4.2 v13.97,13.72 C6.1 | C6.1 16.51,13.72 16.76,13.46 v16.76,12.7 16.76,10.92 16.51,10.67 C7.1 C3.1 | X1.2 28.96,18.54 v29.21,18.29 | C9.2 36.62,18.29 J4.4 | 26.23,14.04 U1.3 28.7,14.04 | 28.7,14.04 29.79,14.04 29.97,14.22 C8.1 | U1.5 28.81,15.64 28.96,15.49 28.96,14.29 28.7,14.04 | C13.2 31.24,6.6 31.5,6.35 C2.2
  Top 0.813: C11.2 9.91,25.91 TSOC.12B | J4.4 39.16,17.57 v39.37,17.78 | C2.2 36.78,6.35 J3.4
  Bottom 0.61: J1.4 7.11,13.72 v13.97,13.72 | v16.76,12.7 17.53,12.7 17.78,12.45 18.29,12.45 18.8,13.21 20.83,13.21 21.08,13.46 26.23,13.46 26.23,13.9 v26.16,13.97 | 35.56,13.21 35.56,13.46 36.58,14.48 39.37,14.48
  Bottom 0.813: TSOC.12B 9.14,28.45 | 9.14,28.45 v20.57,28.45 40.39,28.45 40.39,26.16 39.37,25.15 v39.37,17.78 39.37,14.48 39.37,6.86 | 39.37,6.86 39.37,2.03 31.5,2.03 J6.1 J6.2 | 9.14,28.45 4.83,28.45 v4.83,25.91 4.83,23.37 | 4.83,23.37 4.83,3.81 TSOC.12C | J2.4 5.03,23.57 4.83,23.37 | v29.21,18.29 36.62,18.29 J4.4 | J3.4 39.32,6.91 39.37,6.86
  pour Top (isolate 0.254, rank 2, hatched): 5.84,0 5.84,30.48 38.61,30.48 38.61,0
  pour Bottom (isolate 0.254, rank 2, hatched): 5.84,0 5.84,30.48 38.61,30.48 38.61,0
LEDR
  Top 0.254: LED2.- R11.1
N$17
  Top 0.254: R10.1 LED1.+
TSOC_3V3
  Top 0.61: L2.2 12.45,25.91 TSOC.11B
TSOC_5V0
  Top 0.61: L1.2 12.45,4.57 TSOC.11C
VCC  (via drill 0.36)
  Top 0.254: R1.2 13.72,2.54 7.62,2.54 | LED2.+ 40.64,29.21 41.4,29.97 43.18,29.97 43.94,29.21 43.94,25.15 43.69,24.89 v40.64,24.89 | C11.1 7.11,26.16 R10.2
  Top 0.406: U1.18 U1.19 16.83,16.44 v16.76,16.51 16.76,19.56 16.51,19.81 15.75,19.81 15.49,20.07 PRG.1 | 25.91,1.27 26.92,2.29 27.18,2.29 27.43,2.54 32,2.54 32.51,2.03 | U1.6 26.23,16.44 v26.16,16.51 26.16,15.24 26.56,14.84 U1.4 | C8.2 30.23,16.51 v31.75,16.51
  Top 0.61: C5.1 R3.2 9.14,10.67 8.91,10.91 J1.3 | v13.97,12.19 C6.2 | R2.2 9.4,5.59 8.38,5.59 7.62,4.83 | C9.1 35.56,16.76 36.58,15.75 v37.59,15.75 | R8.2 37.1,19.81 J4.3 | R7.2 v8.64,21.84 7.38,21.84 J2.3 | R6.2 8.89,18.8 v8.64,19.05 | R9.2 35.81,24.38 36.32,24.89 v40.64,24.89 | C13.1 31.24,9.4 31.5,9.14 34.04,9.14 R4.2
  Top 0.813: R7.2 C11.1 | J2.3 3.57,21.57 v3.56,21.59 | v3.56,5.08 7.37,5.08 7.62,4.83 7.62,2.54 7.62,1.52 J5.2 | v6.35,14.73 v3.56,14.73 | v3.56,10.92 7.1,10.92 J1.3 | v37.59,15.75 v40.64,15.75 | v40.64,19.56 37.35,19.56 J4.3 | v32.77,0.76 32.77,1.78 32.51,2.03 | J6.3 25.91,1.27 | v40.64,8.89 40.62,8.91 J3.3 34.31,8.91 34.29,8.89 | R5.2 C9.1 | R4.2 34.29,8.89 | 34.29,8.89 C2.1
  Bottom 0.178: 40.66,8.53 40.72,8.53 v40.64,8.89
  Bottom 0.61: v13.97,12.19 8.91,12.19 7.62,10.91 J1.3 | v8.64,19.05 v8.64,21.84
  Bottom 0.813: v3.56,21.59 v3.56,14.73 v3.56,10.92 v3.56,5.08 | v6.35,14.73 16.76,14.73 v16.76,16.51 v26.16,16.51 v31.75,16.51 35.56,16.51 36.32,15.75 v37.59,15.75 | v40.64,8.89 v40.64,15.75 v40.64,19.56 v40.64,24.89 | 40.66,8.91 40.66,8.53 40.66,1.03 40.64,1.02 40.64,0.76 v32.77,0.76
XIN
  Top 0.305: X1.3 30.16,17.96 29.46,17.27 27.69,17.27 U1.7
XOUT
  Top 0.305: U1.8 27.66,19.97 X1.1

### Text on the board
tPlace: GND | 3V3 | D11 | D12 | D13 | D10 | D9 | A0 | D8 | D7 | D6 | D5 | VCC | !RST | GND | 16Mhz | ATMEGA / -328P | PatternAgents | Grovey One! | A4 | A5 | D1 | D0 | D2 | D3 | D4 | A1 | 3.3V | A2 | A3
bPlace: GND | 3V3 | D11 | D12 | D13 | D10 | D9 | A0 | D8 | D7 | D6 | D5 | GND | A3 | VCC | PatternAgents | D5 | J2 | D11 | VCC | J4 | D13 | TSOC_GROVEY_ONE! | GND | Rev. 1.0 | Serial Number: | GND | A1 | VCC | D4 | J1 | A4 | VCC | J3 | A5 | GND | GND | 5V0 | A4 | A5 | D1 | D0 | D2 | D3 | D4 | A1 | A2 | A3 | 5V0 | 3V3 | VCC | FTDI | !DTR | GND | UART